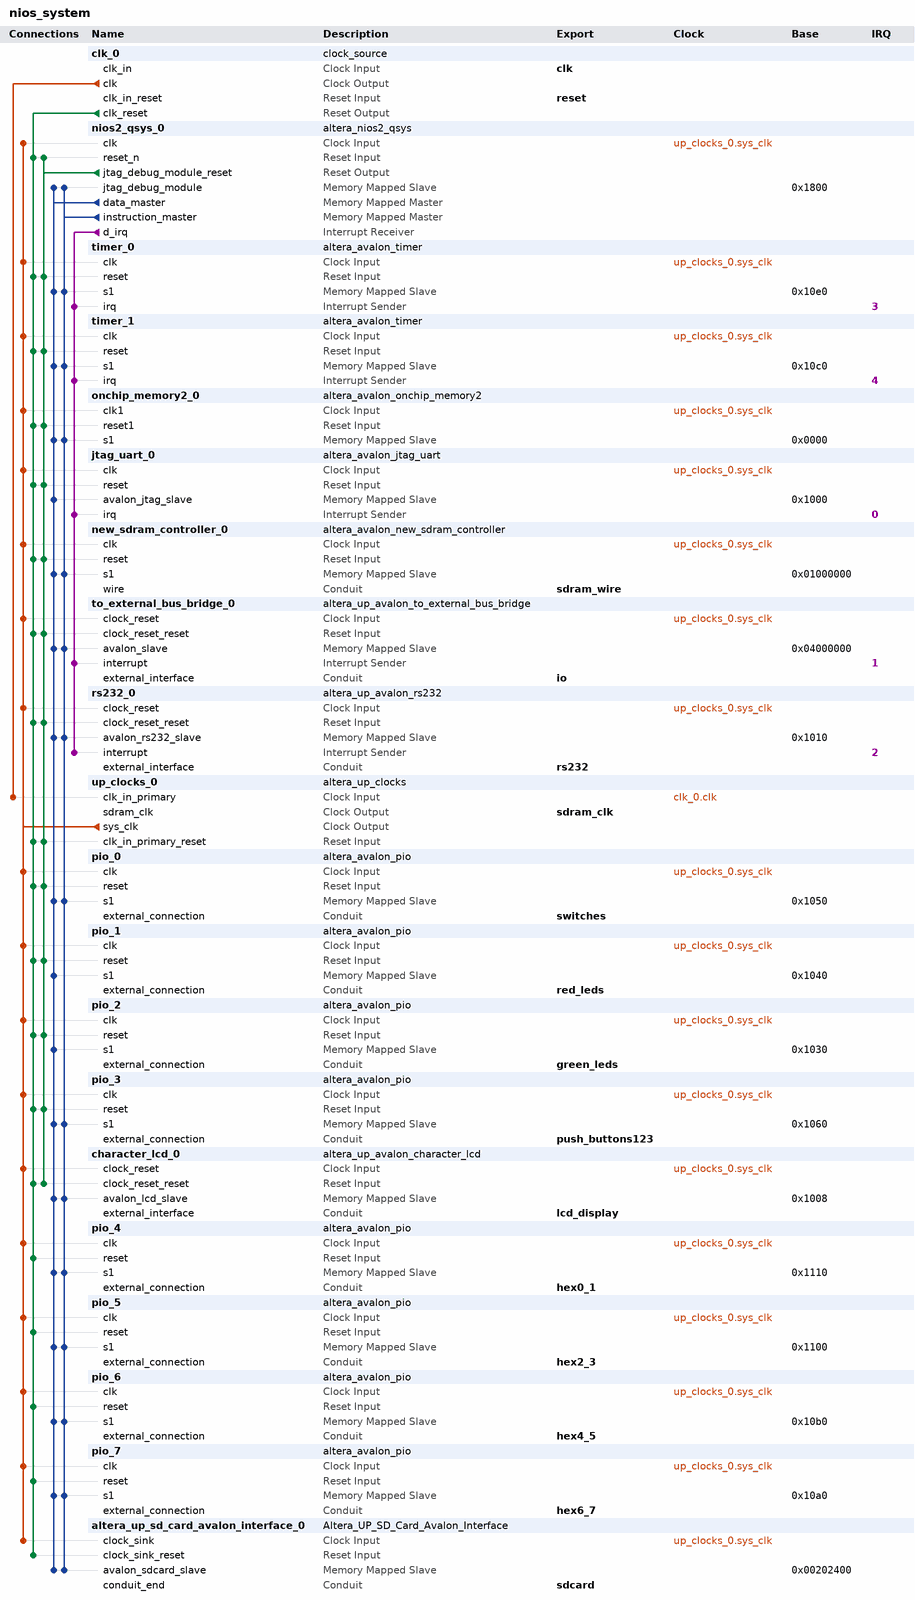
[diagram p0: system contents]
# Platform Designer (Qsys) system nios_system, Cyclone II EP2C35F672C6
# Parameters at their usual value, and those the tool derives, are not listed.
package require -exact qsys 13.0.1.99.2
create_system nios_system
set_project_property DEVICE_FAMILY {Cyclone II}
set_project_property DEVICE EP2C35F672C6

add_instance clk_0 clock_source 13.0
set_instance_parameter_value clk_0 clockFrequency 50000000

add_instance nios2_qsys_0 altera_nios2_qsys 13.0
set_instance_parameter_value nios2_qsys_0 muldiv_divider true
set_instance_parameter_value nios2_qsys_0 resetSlave new_sdram_controller_0.s1
set_instance_parameter_value nios2_qsys_0 mmu_TLBMissExcSlave None
set_instance_parameter_value nios2_qsys_0 exceptionSlave new_sdram_controller_0.s1
set_instance_parameter_value nios2_qsys_0 breakSlave nios2_qsys_0.jtag_debug_module
set_instance_parameter_value nios2_qsys_0 impl Fast
set_instance_parameter_value nios2_qsys_0 icache_size 16384

add_instance timer_0 altera_avalon_timer 13.0.1.99.2
set_instance_parameter_value timer_0 period 1
set_instance_parameter_value timer_0 periodUnits MSEC

add_instance timer_1 altera_avalon_timer 13.0.1.99.2
set_instance_parameter_value timer_1 period 1
set_instance_parameter_value timer_1 periodUnits MSEC

add_instance onchip_memory2_0 altera_avalon_onchip_memory2 13.0.1.99.2
set_instance_parameter_value onchip_memory2_0 dataWidth 32
set_instance_parameter_value onchip_memory2_0 dualPort false
set_instance_parameter_value onchip_memory2_0 initMemContent true
set_instance_parameter_value onchip_memory2_0 initializationFileName onchip_mem.hex
set_instance_parameter_value onchip_memory2_0 memorySize 4096

add_instance jtag_uart_0 altera_avalon_jtag_uart 13.0.1.99.2
set_instance_parameter_value jtag_uart_0 simInteractiveOptions NO_INTERACTIVE_WINDOWS

add_instance new_sdram_controller_0 altera_avalon_new_sdram_controller 13.0.1.99.2
set_instance_parameter_value new_sdram_controller_0 TAC 5.5
set_instance_parameter_value new_sdram_controller_0 TRCD 20.0
set_instance_parameter_value new_sdram_controller_0 TRP 20.0
set_instance_parameter_value new_sdram_controller_0 casLatency 3
set_instance_parameter_value new_sdram_controller_0 columnWidth 8
set_instance_parameter_value new_sdram_controller_0 dataWidth 16
set_instance_parameter_value new_sdram_controller_0 generateSimulationModel false
set_instance_parameter_value new_sdram_controller_0 model single_Micron_MT48LC4M32B2_7_chip
set_instance_parameter_value new_sdram_controller_0 numberOfBanks 4
set_instance_parameter_value new_sdram_controller_0 numberOfChipSelects 1
set_instance_parameter_value new_sdram_controller_0 powerUpDelay 100.0
set_instance_parameter_value new_sdram_controller_0 refreshPeriod 15.625
set_instance_parameter_value new_sdram_controller_0 rowWidth 12

add_instance to_external_bus_bridge_0 altera_up_avalon_to_external_bus_bridge 12.0
set_instance_parameter_value to_external_bus_bridge_0 addr_size 64
set_instance_parameter_value to_external_bus_bridge_0 addr_size_multiplier Kbytes
set_instance_parameter_value to_external_bus_bridge_0 data_size 16

add_instance rs232_0 altera_up_avalon_rs232 12.0
set_instance_parameter_value rs232_0 baud 115200
set_instance_parameter_value rs232_0 parity None

add_instance up_clocks_0 altera_up_clocks 12.0
set_instance_parameter_value up_clocks_0 board DE2
set_instance_parameter_value up_clocks_0 vga_clk false
set_instance_parameter_value up_clocks_0 audio_clk false
set_instance_parameter_value up_clocks_0 audio_clk_freq 12.288

add_instance pio_0 altera_avalon_pio 13.0.1.99.2
set_instance_parameter_value pio_0 direction Input
set_instance_parameter_value pio_0 width 18

add_instance pio_1 altera_avalon_pio 13.0.1.99.2
set_instance_parameter_value pio_1 direction Output
set_instance_parameter_value pio_1 width 18

add_instance pio_2 altera_avalon_pio 13.0.1.99.2
set_instance_parameter_value pio_2 direction Output
set_instance_parameter_value pio_2 width 8

add_instance pio_3 altera_avalon_pio 13.0.1.99.2
set_instance_parameter_value pio_3 direction Input
set_instance_parameter_value pio_3 width 3

add_instance character_lcd_0 altera_up_avalon_character_lcd 12.0
set_instance_parameter_value character_lcd_0 cursor Normal

add_instance pio_4 altera_avalon_pio 13.0.1.99.2
set_instance_parameter_value pio_4 direction Output
set_instance_parameter_value pio_4 width 8

add_instance pio_5 altera_avalon_pio 13.0.1.99.2
set_instance_parameter_value pio_5 direction Output
set_instance_parameter_value pio_5 width 8

add_instance pio_6 altera_avalon_pio 13.0.1.99.2
set_instance_parameter_value pio_6 direction Output
set_instance_parameter_value pio_6 width 8

add_instance pio_7 altera_avalon_pio 13.0.1.99.2
set_instance_parameter_value pio_7 direction Output
set_instance_parameter_value pio_7 width 8

add_instance altera_up_sd_card_avalon_interface_0 Altera_UP_SD_Card_Avalon_Interface 1.0

# connections
add_connection clk_0.clk up_clocks_0.clk_in_primary clock
add_connection up_clocks_0.sys_clk altera_up_sd_card_avalon_interface_0.clock_sink clock
add_connection up_clocks_0.sys_clk character_lcd_0.clock_reset clock
add_connection up_clocks_0.sys_clk jtag_uart_0.clk clock
add_connection up_clocks_0.sys_clk new_sdram_controller_0.clk clock
add_connection up_clocks_0.sys_clk nios2_qsys_0.clk clock
add_connection up_clocks_0.sys_clk onchip_memory2_0.clk1 clock
add_connection up_clocks_0.sys_clk pio_0.clk clock
add_connection up_clocks_0.sys_clk pio_1.clk clock
add_connection up_clocks_0.sys_clk pio_2.clk clock
add_connection up_clocks_0.sys_clk pio_3.clk clock
add_connection up_clocks_0.sys_clk pio_4.clk clock
add_connection up_clocks_0.sys_clk pio_5.clk clock
add_connection up_clocks_0.sys_clk pio_6.clk clock
add_connection up_clocks_0.sys_clk pio_7.clk clock
add_connection up_clocks_0.sys_clk rs232_0.clock_reset clock
add_connection up_clocks_0.sys_clk timer_0.clk clock
add_connection up_clocks_0.sys_clk timer_1.clk clock
add_connection up_clocks_0.sys_clk to_external_bus_bridge_0.clock_reset clock
add_connection clk_0.clk_reset altera_up_sd_card_avalon_interface_0.clock_sink_reset reset
add_connection clk_0.clk_reset character_lcd_0.clock_reset_reset reset
add_connection clk_0.clk_reset jtag_uart_0.reset reset
add_connection clk_0.clk_reset new_sdram_controller_0.reset reset
add_connection clk_0.clk_reset nios2_qsys_0.reset_n reset
add_connection clk_0.clk_reset onchip_memory2_0.reset1 reset
add_connection clk_0.clk_reset pio_0.reset reset
add_connection clk_0.clk_reset pio_1.reset reset
add_connection clk_0.clk_reset pio_2.reset reset
add_connection clk_0.clk_reset pio_3.reset reset
add_connection clk_0.clk_reset pio_4.reset reset
add_connection clk_0.clk_reset pio_5.reset reset
add_connection clk_0.clk_reset pio_6.reset reset
add_connection clk_0.clk_reset pio_7.reset reset
add_connection clk_0.clk_reset rs232_0.clock_reset_reset reset
add_connection clk_0.clk_reset timer_0.reset reset
add_connection clk_0.clk_reset timer_1.reset reset
add_connection clk_0.clk_reset to_external_bus_bridge_0.clock_reset_reset reset
add_connection clk_0.clk_reset up_clocks_0.clk_in_primary_reset reset
add_connection nios2_qsys_0.jtag_debug_module_reset character_lcd_0.clock_reset_reset reset
add_connection nios2_qsys_0.jtag_debug_module_reset jtag_uart_0.reset reset
add_connection nios2_qsys_0.jtag_debug_module_reset new_sdram_controller_0.reset reset
add_connection nios2_qsys_0.jtag_debug_module_reset nios2_qsys_0.reset_n reset
add_connection nios2_qsys_0.jtag_debug_module_reset onchip_memory2_0.reset1 reset
add_connection nios2_qsys_0.jtag_debug_module_reset pio_0.reset reset
add_connection nios2_qsys_0.jtag_debug_module_reset pio_1.reset reset
add_connection nios2_qsys_0.jtag_debug_module_reset pio_2.reset reset
add_connection nios2_qsys_0.jtag_debug_module_reset pio_3.reset reset
add_connection nios2_qsys_0.jtag_debug_module_reset rs232_0.clock_reset_reset reset
add_connection nios2_qsys_0.jtag_debug_module_reset timer_0.reset reset
add_connection nios2_qsys_0.jtag_debug_module_reset timer_1.reset reset
add_connection nios2_qsys_0.jtag_debug_module_reset to_external_bus_bridge_0.clock_reset_reset reset
add_connection nios2_qsys_0.jtag_debug_module_reset up_clocks_0.clk_in_primary_reset reset
add_connection nios2_qsys_0.data_master altera_up_sd_card_avalon_interface_0.avalon_sdcard_slave avalon
set_connection_parameter_value nios2_qsys_0.data_master/altera_up_sd_card_avalon_interface_0.avalon_sdcard_slave baseAddress 0x00202400
add_connection nios2_qsys_0.data_master character_lcd_0.avalon_lcd_slave avalon
set_connection_parameter_value nios2_qsys_0.data_master/character_lcd_0.avalon_lcd_slave baseAddress 0x1008
add_connection nios2_qsys_0.data_master jtag_uart_0.avalon_jtag_slave avalon
set_connection_parameter_value nios2_qsys_0.data_master/jtag_uart_0.avalon_jtag_slave baseAddress 0x1000
add_connection nios2_qsys_0.data_master new_sdram_controller_0.s1 avalon
set_connection_parameter_value nios2_qsys_0.data_master/new_sdram_controller_0.s1 baseAddress 0x01000000
add_connection nios2_qsys_0.data_master nios2_qsys_0.jtag_debug_module avalon
set_connection_parameter_value nios2_qsys_0.data_master/nios2_qsys_0.jtag_debug_module baseAddress 0x1800
add_connection nios2_qsys_0.data_master onchip_memory2_0.s1 avalon
set_connection_parameter_value nios2_qsys_0.data_master/onchip_memory2_0.s1 baseAddress 0x0000
add_connection nios2_qsys_0.data_master pio_0.s1 avalon
set_connection_parameter_value nios2_qsys_0.data_master/pio_0.s1 baseAddress 0x1050
add_connection nios2_qsys_0.data_master pio_1.s1 avalon
set_connection_parameter_value nios2_qsys_0.data_master/pio_1.s1 baseAddress 0x1040
add_connection nios2_qsys_0.data_master pio_2.s1 avalon
set_connection_parameter_value nios2_qsys_0.data_master/pio_2.s1 baseAddress 0x1030
add_connection nios2_qsys_0.data_master pio_3.s1 avalon
set_connection_parameter_value nios2_qsys_0.data_master/pio_3.s1 baseAddress 0x1060
add_connection nios2_qsys_0.data_master pio_4.s1 avalon
set_connection_parameter_value nios2_qsys_0.data_master/pio_4.s1 baseAddress 0x1110
add_connection nios2_qsys_0.data_master pio_5.s1 avalon
set_connection_parameter_value nios2_qsys_0.data_master/pio_5.s1 baseAddress 0x1100
add_connection nios2_qsys_0.data_master pio_6.s1 avalon
set_connection_parameter_value nios2_qsys_0.data_master/pio_6.s1 baseAddress 0x10b0
add_connection nios2_qsys_0.data_master pio_7.s1 avalon
set_connection_parameter_value nios2_qsys_0.data_master/pio_7.s1 baseAddress 0x10a0
add_connection nios2_qsys_0.data_master rs232_0.avalon_rs232_slave avalon
set_connection_parameter_value nios2_qsys_0.data_master/rs232_0.avalon_rs232_slave baseAddress 0x1010
add_connection nios2_qsys_0.data_master timer_0.s1 avalon
set_connection_parameter_value nios2_qsys_0.data_master/timer_0.s1 baseAddress 0x10e0
add_connection nios2_qsys_0.data_master timer_1.s1 avalon
set_connection_parameter_value nios2_qsys_0.data_master/timer_1.s1 baseAddress 0x10c0
add_connection nios2_qsys_0.data_master to_external_bus_bridge_0.avalon_slave avalon
set_connection_parameter_value nios2_qsys_0.data_master/to_external_bus_bridge_0.avalon_slave baseAddress 0x04000000
add_connection nios2_qsys_0.instruction_master altera_up_sd_card_avalon_interface_0.avalon_sdcard_slave avalon
set_connection_parameter_value nios2_qsys_0.instruction_master/altera_up_sd_card_avalon_interface_0.avalon_sdcard_slave baseAddress 0x00202400
add_connection nios2_qsys_0.instruction_master character_lcd_0.avalon_lcd_slave avalon
set_connection_parameter_value nios2_qsys_0.instruction_master/character_lcd_0.avalon_lcd_slave baseAddress 0x1008
add_connection nios2_qsys_0.instruction_master new_sdram_controller_0.s1 avalon
set_connection_parameter_value nios2_qsys_0.instruction_master/new_sdram_controller_0.s1 baseAddress 0x01000000
add_connection nios2_qsys_0.instruction_master nios2_qsys_0.jtag_debug_module avalon
set_connection_parameter_value nios2_qsys_0.instruction_master/nios2_qsys_0.jtag_debug_module baseAddress 0x1800
add_connection nios2_qsys_0.instruction_master onchip_memory2_0.s1 avalon
set_connection_parameter_value nios2_qsys_0.instruction_master/onchip_memory2_0.s1 baseAddress 0x0000
add_connection nios2_qsys_0.instruction_master pio_0.s1 avalon
set_connection_parameter_value nios2_qsys_0.instruction_master/pio_0.s1 baseAddress 0x1050
add_connection nios2_qsys_0.instruction_master pio_3.s1 avalon
set_connection_parameter_value nios2_qsys_0.instruction_master/pio_3.s1 baseAddress 0x1060
add_connection nios2_qsys_0.instruction_master pio_4.s1 avalon
set_connection_parameter_value nios2_qsys_0.instruction_master/pio_4.s1 baseAddress 0x1110
add_connection nios2_qsys_0.instruction_master pio_5.s1 avalon
set_connection_parameter_value nios2_qsys_0.instruction_master/pio_5.s1 baseAddress 0x1100
add_connection nios2_qsys_0.instruction_master pio_6.s1 avalon
set_connection_parameter_value nios2_qsys_0.instruction_master/pio_6.s1 baseAddress 0x10b0
add_connection nios2_qsys_0.instruction_master pio_7.s1 avalon
set_connection_parameter_value nios2_qsys_0.instruction_master/pio_7.s1 baseAddress 0x10a0
add_connection nios2_qsys_0.instruction_master rs232_0.avalon_rs232_slave avalon
set_connection_parameter_value nios2_qsys_0.instruction_master/rs232_0.avalon_rs232_slave baseAddress 0x1010
add_connection nios2_qsys_0.instruction_master timer_0.s1 avalon
set_connection_parameter_value nios2_qsys_0.instruction_master/timer_0.s1 baseAddress 0x10e0
add_connection nios2_qsys_0.instruction_master timer_1.s1 avalon
set_connection_parameter_value nios2_qsys_0.instruction_master/timer_1.s1 baseAddress 0x10c0
add_connection nios2_qsys_0.instruction_master to_external_bus_bridge_0.avalon_slave avalon
set_connection_parameter_value nios2_qsys_0.instruction_master/to_external_bus_bridge_0.avalon_slave baseAddress 0x04000000
add_connection nios2_qsys_0.d_irq jtag_uart_0.irq interrupt
set_connection_parameter_value nios2_qsys_0.d_irq/jtag_uart_0.irq irqNumber 0
add_connection nios2_qsys_0.d_irq rs232_0.interrupt interrupt
set_connection_parameter_value nios2_qsys_0.d_irq/rs232_0.interrupt irqNumber 2
add_connection nios2_qsys_0.d_irq timer_0.irq interrupt
set_connection_parameter_value nios2_qsys_0.d_irq/timer_0.irq irqNumber 3
add_connection nios2_qsys_0.d_irq timer_1.irq interrupt
set_connection_parameter_value nios2_qsys_0.d_irq/timer_1.irq irqNumber 4
add_connection nios2_qsys_0.d_irq to_external_bus_bridge_0.interrupt interrupt
set_connection_parameter_value nios2_qsys_0.d_irq/to_external_bus_bridge_0.interrupt irqNumber 1

# exported interfaces
add_interface clk clock sink
set_interface_property clk EXPORT_OF clk_0.clk_in
add_interface reset reset sink
set_interface_property reset EXPORT_OF clk_0.clk_in_reset
add_interface sdram_wire conduit end
set_interface_property sdram_wire EXPORT_OF new_sdram_controller_0.wire
add_interface io conduit end
set_interface_property io EXPORT_OF to_external_bus_bridge_0.external_interface
add_interface rs232 conduit end
set_interface_property rs232 EXPORT_OF rs232_0.external_interface
add_interface switches conduit end
set_interface_property switches EXPORT_OF pio_0.external_connection
add_interface red_leds conduit end
set_interface_property red_leds EXPORT_OF pio_1.external_connection
add_interface green_leds conduit end
set_interface_property green_leds EXPORT_OF pio_2.external_connection
add_interface lcd_display conduit end
set_interface_property lcd_display EXPORT_OF character_lcd_0.external_interface
add_interface sdram_clk clock source
set_interface_property sdram_clk EXPORT_OF up_clocks_0.sdram_clk
add_interface push_buttons123 conduit end
set_interface_property push_buttons123 EXPORT_OF pio_3.external_connection
add_interface hex0_1 conduit end
set_interface_property hex0_1 EXPORT_OF pio_4.external_connection
add_interface hex2_3 conduit end
set_interface_property hex2_3 EXPORT_OF pio_5.external_connection
add_interface hex4_5 conduit end
set_interface_property hex4_5 EXPORT_OF pio_6.external_connection
add_interface hex6_7 conduit end
set_interface_property hex6_7 EXPORT_OF pio_7.external_connection
add_interface sdcard conduit end
set_interface_property sdcard EXPORT_OF altera_up_sd_card_avalon_interface_0.conduit_end

set_interconnect_requirement {$system} qsys_mm.clockCrossingAdapter HANDSHAKE
set_interconnect_requirement {$system} qsys_mm.maxAdditionalLatency 1

save_system nios_system.qsys
